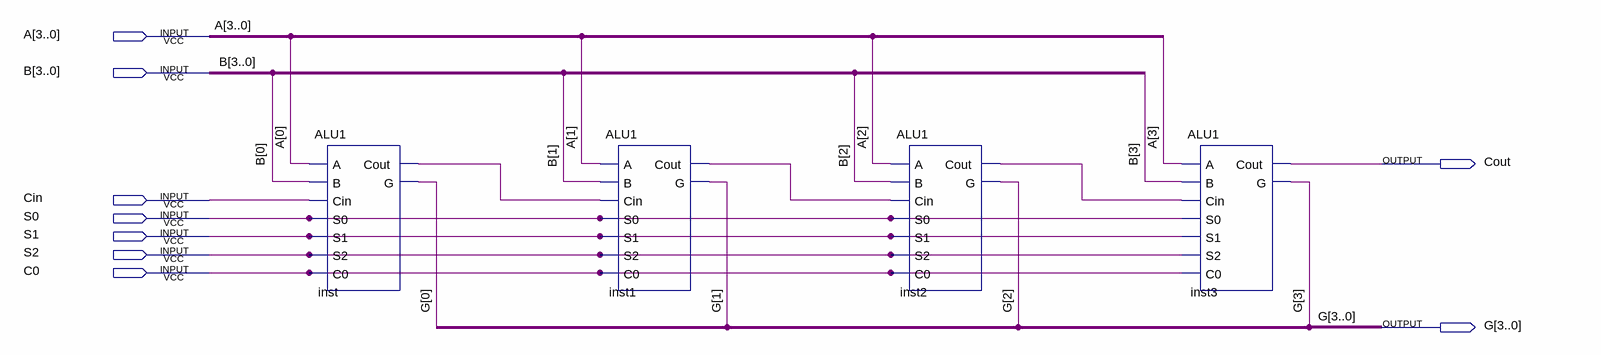
[diagram p0: schematic sheet]
// Quartus schematic ALU4.bdf as structural Verilog: 4 symbols, 9 pins
module ALU4 (
  input  [3:0] A,
  input  [3:0] B,
  input  Cin,
  input  S0,
  input  S1,
  input  S2,
  input  C0,
  output Cout,
  output [3:0] G
);

  wire inst1_cout, inst2_cout, inst_cout;

  ALU1 inst (.A(A[0]), .B(B[0]), .Cin(Cin), .S0(S0), .S1(S1), .S2(S2), .C0(C0), .Cout(inst_cout), .G(G[0]));
  ALU1 inst1 (.A(A[1]), .B(B[1]), .Cin(inst_cout), .S0(S0), .S1(S1), .S2(S2), .C0(C0), .Cout(inst1_cout), .G(G[1]));
  ALU1 inst2 (.A(A[2]), .B(B[2]), .Cin(inst1_cout), .S0(S0), .S1(S1), .S2(S2), .C0(C0), .Cout(inst2_cout), .G(G[2]));
  ALU1 inst3 (.A(A[3]), .B(B[3]), .Cin(inst2_cout), .S0(S0), .S1(S1), .S2(S2), .C0(C0), .Cout(Cout), .G(G[3]));
endmodule
